# Altium schematic sheet Pmaster-A9112-HOST_0.SchDoc
size A3; SheetNumber: 0; SheetTotal: 0
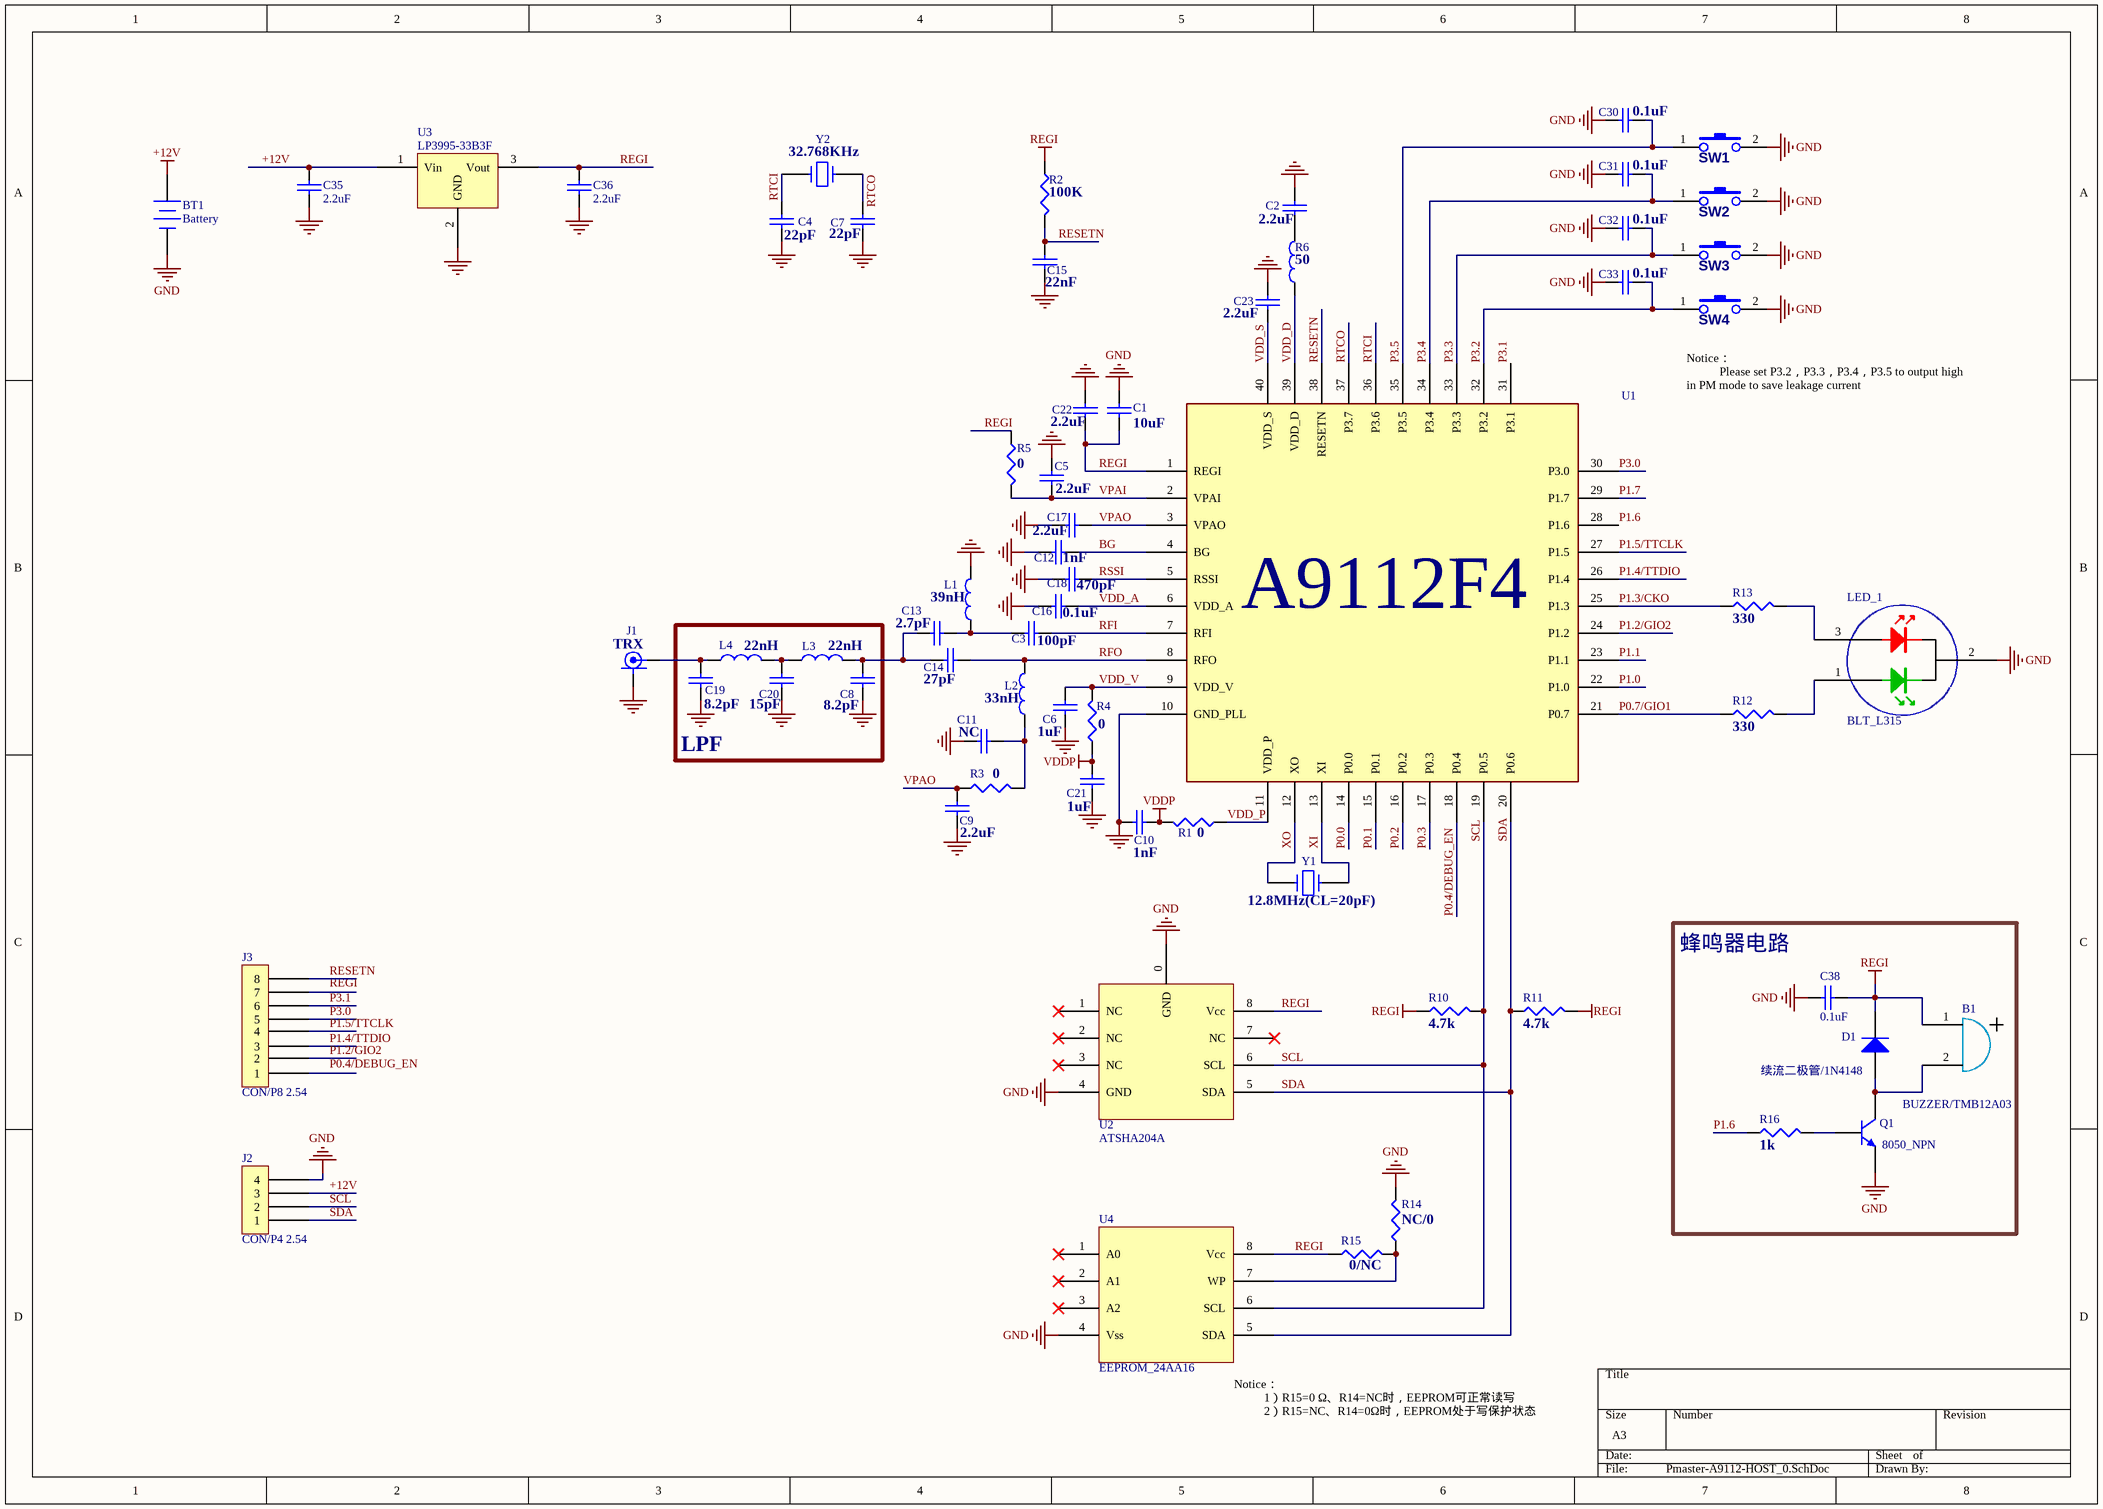
[diagram p0: Pmaster-A9112-HOST_0.SchDoc]

## Parts
B1  BUZZER/TMB12A03  [BUZEER]
BT1  Battery  [BAT-2]
C1  10uF  [1206]
C2  2.2uF  [0603]
C3  100pF  [0402]
C4  22pF  [0402]
C5  2.2uF  [0603]
C6  1uF  [0603]
C7  22pF  [0402]
C8  8.2pF  [0402]
C9  2.2uF  [0603]
C10  1nF  [0402]
C11  NC  [0402]
C12  1nF  [0402]
C13  2.7pF  [0402]
C14  27pF  [0402]
C15  22nF  [0402]
C16  0.1uF  [0603]
C17  2.2uF  [0603]
C18  470pF  [0402]
C19  8.2pF  [0402]
C20  15pF  [0402]
C21  1uF  [0402]
C22  2.2uF  [0603]
C23  2.2uF  [0603]
C30  0.1uF  [0603]
C31  0.1uF  [0603]
C32  0.1uF  [0603]
C33  0.1uF  [0603]
C35  2.2uF  [0603]
C36  2.2uF  [0603]
C38  0.1uF  [A0402]
D1  续流二极管/1N4148  [0805]
J1  TRX  [SMA CONNECTOR]
J2  CON/P4 2.54  [HDR4_2.54]
J3  CON/P8 2.54  [HDR8_2.54]
L1  39nH  [0402]
L2  33nH  [0402]
L3  22nH  [0402]
L4  22nH  [0402]
LED_1  BLT_L315  [LED_BI-COLOR]
Q1  8050_NPN  [SOT23_N]
R1  0  [0402]
R2  100K  [0402]
R3  0  [0402]
R4  0  [0402]
R5  0  [0402]
R6  50  [0402]
R10  4.7k  [0402]
R11  4.7k  [0402]
R12  330  [0402]
R13  330  [0402]
R14  NC/0  [0402]
R15  0/NC  [0402]
R16  1k  [0402]
SW1  SW-PB\2P  [SW4P]  (value not drawn)
SW2  SW-PB\2P  [SW4P]  (value not drawn)
SW3  SW-PB\2P  [SW4P]  (value not drawn)
SW4  SW-PB\2P  [SW4P]  (value not drawn)
U1  A9112F4  [QFN40_5*5]
U2  ATSHA204A  [UDFN_8P]
U3  LP3995-33B3F  [SOT-23_N]
U4  EEPROM_24AA16  [MSOP-MS8_N]
Y1  12.8MHz(CL=20pF)  [XTAL1]
Y2  32.768KHz  [XTAL_3215]

## Blocks framed on the sheet
LPF: C8 C19 C20 L3 L4
蜂鸣器电路: B1 C38 D1 Q1 R16

## Nets
+12V: BT1.1(+) C35.2 J2.3 U3.1(Vin)
GND: BT1.2(-) C1.2 C2.1 C4.2 C5.2 C7.2 C8.1 C9.2 C10.1 C11.1 C12.2 C15.2 C16.1 C17.2 C18.1 C19.2 C20.2 C21.1 C22.1 C23.1 C30.1 C31.1 C32.1 C33.1 C35.1 C36.2 C38.1 J1.0(SHIELD) J2.4 L1.2 LED_1.2 Q1.3(E) R14.2 SW1.2 SW2.2 SW3.2 SW4.2 U1.10(GND_PLL) U2.0(GND) U2.4(GND) U3.2(GND) U4.4(Vss)
REGI: B1.1 C1.1 C22.2 C36.1 C38.2 D1.2(K) R2.1 R5.1 R10.1 R11.2 R15.1 U1.1(REGI) U2.8(Vcc) U3.3(Vout) U4.8(Vcc)
VCO_GND: C6.2
VDDP: C10.2 C21.2 R1.2 R4.1
BG: C12.1 U1.4(BG)
P0.0: U1.14(P0.0)
P0.1: U1.15(P0.1)
P0.2: U1.16(P0.2)
P0.3: U1.17(P0.3)
P0.4/DEBUG_EN: U1.18(P0.4)
P0.7/GIO1: R12.1 U1.21(P0.7)
P1.0: U1.22(P1.0)
P1.1: U1.23(P1.1)
P1.2/GIO2: J3.2 U1.24(P1.2)
P1.3/CKO: R13.1 U1.25(P1.3)
P1.4/TTDIO: J3.3 U1.26(P1.4)
P1.5/TTCLK: J3.4 U1.27(P1.5)
P1.6: R16.1 U1.28(P1.6)
P1.7: U1.29(P1.7)
P3.0: J3.5 U1.30(P3.0)
P3.1: J3.6 U1.31(P3.1)
P3.2: C33.2 SW4.1 U1.32(P3.2)
P3.3: C32.2 SW3.1 U1.33(P3.3)
P3.4: C31.2 SW2.1 U1.34(P3.4)
P3.5: C30.2 SW1.1 U1.35(P3.5)
RESETN: C15.1 J3.8 R2.2 U1.38(RESETN)
RFI: C3.1 U1.7(RFI)
RFO: C14.1 L2.2 U1.8(RFO)
RSSI: C18.2 U1.5(RSSI)
RTCI: C4.1 U1.36(P3.6) Y2.1
RTCO: C7.1 U1.37(P3.7) Y2.2
SCL: J2.2 R10.2 U1.19(P0.5) U2.6(SCL) U4.6(SCL)
SDA: J2.1 R11.1 U1.20(P0.6) U2.5(SDA) U4.5(SDA)
VDD_A: C16.2 U1.6(VDD_A)
VDD_D: R6.1 U1.39(VDD_D)
VDD_P: R1.1 U1.11(VDD_P)
VDD_S: C23.2 U1.40(VDD_S)
VDD_V: C6.1 R4.2 U1.9(VDD_V)
VPAI: C5.1 R5.2 U1.2(VPAI)
VPAO: C9.1 C17.1 R3.1 U1.3(VPAO)
XI: U1.13(XI) Y1.1
XO: U1.12(XO) Y1.2
NetB1_2: B1.2 D1.1(A) Q1.1(C)
NetC2_2: C2.2 R6.2
NetC3_2: C3.2 C13.1 L1.1
NetC8_2: C8.2 C13.2 C14.2 L3.2
NetC11_2: C11.2 L2.1 R3.2
NetC19_1: C19.1 J1.1(CENTER_1) L4.1
NetC20_1: C20.1 L3.1 L4.2
NetLED_1_1: LED_1.1 R12.2
NetLED_1_3: LED_1.3(RED) R13.2
NetQ1_2: Q1.2(B) R16.2
NetR14_1: R14.1 R15.2 U4.7(WP)

Not connected (* = marked no-connect by the designer): J3 1 7; U2 1(NC)* 2(NC)* 3(NC)* 7(NC)*; U4 1(A0)* 2(A1)* 3(A2)*

## Notes on the sheet
- (near SW4) Notice：
  Please set P3.2，P3.3，P3.4，P3.5 to output high in PM mode to save leakage current
- (near U4) Notice：
  1）R15=0 Ω、R14=NC时，EEPROM可正常读写
  2）R15=NC、R14=0Ω时，EEPROM处于写保护状态
- Labels drawn without touching a wire or pin: P0.4/DEBUG_EN, REGI

## Library data of the parts
B1 = BUZZER
BT1 = Battery: Multicell Battery; Published: 24-Mar-1999; LatestRevisionDate: 17-Jul-2002; LatestRevisionNote: Re-released for DXP Platform.; PackageReference: BAT-2; Publisher: Altium Limited; PackageDescription: Battery; 2 Leads
C1-C3 C5 C6 C8 C10 C12-C14 C16 C18 C21-C23 C30-C33 C35 = CAP
C4 C7 = C/0402: Chip C
C9 C11 C17 C19 C20 C36 C38 = C/0603: Chip C
C15 = C/1206: Chip C
D1 = Diode: Default Diode; Published: 8-Jun-2000; LatestRevisionDate: 17-Jul-2002; LatestRevisionNote: Re-released for DXP Platform.; PackageVersion: Sep-1996; PackageReference: SMC; Publisher: Altium Limited; PackageDescription: DO-214-AB/SMC; 2 C-Bend Leads; Body 7.9 x 5.9 mm, inc. leads (LxW); Code_JEDEC: DO-214-AB
J1 = SMA CONNECTOR
L1 L2 = L/0402: Chip L
L3 L4 R6 = L/0603
LED_1 = double_LED
Q1 = NPN: NPN Bipolar Transistor; Published: 8-Jun-2000; LatestRevisionDate: 17-Jul-2002; LatestRevisionNote: Re-released for DXP Platform.; PackageReference: TO-226-AA; Publisher: Altium Limited; PackageDescription: TO, Flat Index; 3 In-Line, Axial Leads; Body Dia. 4.8mm; Leads 0.55 x 0.51 mm (max); Code_JEDEC: TO-226-AA
R1 R5 R10-R16 = RES1
R2 = R/0402: Chip R
R3 R4 = R/0603: Chip  R
U3 = REG\G903\3.3V\SOT-223: GMT 3.3V REGULTOR
Y1 Y2 = CRYSTAL